# EAGLE schematic IF amplifier MC1350 (EAGLE 9.1.2)
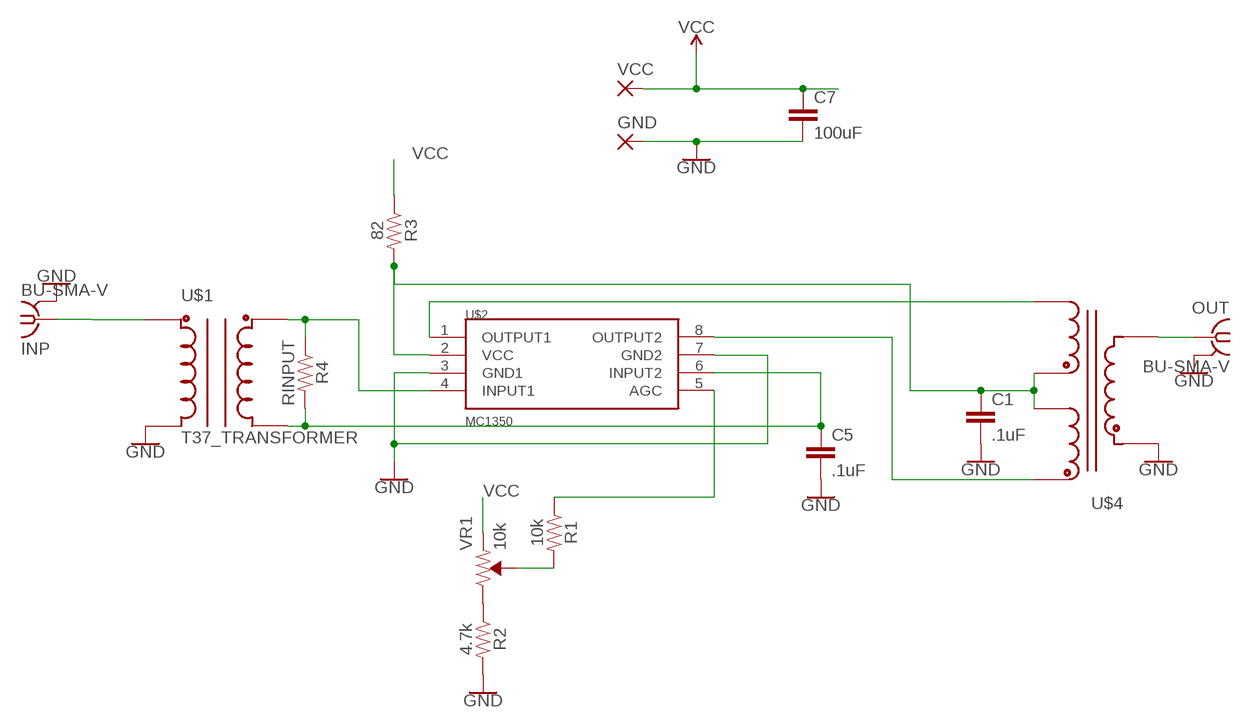
[diagram p0: schematic, sheet 1]

## Parts
C1  .1uF  C5/3.5  [C5B3.5]
C5  .1uF  C5/3.5  [C5B3.5]
C7  100uF  C5/3.5  [C5B3.5]
GND  3,17/1,1  [3,17/1,1]
INP  BU-SMA-V  [BU-SMA-V]
OUT  BU-SMA-V  [BU-SMA-V]
R1  10k  1KOHM-HORIZ-1/4W-1%  [AXIAL-0.3]
R2  4.7k  1KOHM-HORIZ-1/4W-1%  [AXIAL-0.3]
R3  82  1KOHM-HORIZ-1/4W-1%  [AXIAL-0.3]
R4  RINPUT  1KOHM-HORIZ-1/4W-1%  [AXIAL-0.3]
U$1  T37_TRANSFORMER  [T37_TRANSFORMER]
U$2  MC1350  [DIP8]
U$4  T50_SPLITTER  [T50_SPLITTER]
VCC  3,17/1,1  [3,17/1,1]
VR1  10k  TRIMPOT-PTH-10MM-KNOB-1/2W-10%  [TRIMPOT-PTH-3386U]

## Nets
GND: C1.2 C5.2 C7.2 GND.1(P) INP.2 INP.3 INP.4 INP.5 OUT.2 OUT.3 OUT.4 OUT.5 R2.P$2 U$1.C1A U$2.3(GND1) U$2.7(GND2) U$4.C1B
N$1: R4.P$1 U$1.C2B U$2.4(INPUT1)
N$2: U$2.1(OUTPUT1) U$4.C2B(C3A)
N$3: R2.P$1 VR1.3(CW)
N$4: OUT.1 U$4.C1A
N$5: C1.1 R3.P$2 U$2.2(VCC) U$4.C2A(C3B) U$4.C3A(C2A)
N$6: U$2.8(OUTPUT2) U$4.C3B(C2B)
N$7: C5.1 R4.P$2 U$1.C2A U$2.6(INPUT2)
N$8: INP.1 U$1.C1B
N$11: R1.P$1 U$2.5(AGC)
N$12: R1.P$2 VR1.2(WIPER)
VCC: C7.1 R3.P$1 VCC.1(P) VR1.1(CCW)

## Library data of the parts
C1 C5 C7 = capacitor-wima:C: CAPACITOR naming: grid - package width
GND VCC = wirepad:3,17/1,1: THROUGH-HOLE PAD
INP OUT = con-coax:BU-SMA-V: FEMALE SMA CONNECTOR Radiall distributor RS 112-3794; OC_FARNELL: unknown; OC_NEWARK: unknown
R1-R4 = SparkFun-Resistors:1KOHM: 1kΩ resistor A resistor is a passive two-terminal electrical component that implements electrical resistance as a circuit element. Resistors act to reduce current flow, and, at the same time, act to lower voltage levels within circuits. - Wikipedia; PROD_ID: RES-12182; VALUE: 1k
U$1 = toroid:T37_TRANSFORMER: Transformer wound on a T37 Toroid
U$2 = SparkFun-IC-Microcontroller:MC1350: The MC1350 is an integrated circuit featuring wide range AGC for use as an IF amplifier in radio and TV over an operating temperature range of 0° to +75°C. • Power Gain: 50 dB Typ at 45 MHZ • Power Gain: 50 dB Typ at 58 MHZ • AGC Range: 60 dB Min, DC to 45 MHz • Nearly Constant Input & Output Admittance over the Entire AGC Range • Y21 Constant ( –3.0 dB) to 90 MHz • Low Reverse Transfer Admittance: < < 1.0 µmho Typ • 12 V Operation, Single–Polarity Power Supply
U$4 = toroid:T50_SPLITTER: Transformer (having 3 windings) on a T50 Toroid
VR1 = SparkFun-Resistors:TRIMPOT: Trimming Potentiometer (Trimpot) Three-terminal potentiometers, with an adjustable wiper and two adjustable resistors. A pot can be used to create a configurable voltage divider, or as a variable resistor. "Trimpots" are a subset of potentiometers, usually intended for "set-and-forget" applications. They're often more delicate than standard potentiometers - rated for fewer turns. Variants PTH-KNOB - PTH Trimpot w/ finger-adjustable knob Trimpot 10K with Knob <https://www.sparkfun.com/products/9806> (COM-09806) Datasheet <http://www.sparkfun.com/datasheets/Components/General/TSR-3386.pdf> SMD-3MM-CLOSED-FRAME - SMD 3mm Square Closed-Frame Trimpot Used on e.g. EasyDriver - Stepper Motor Driver <https://www.sparkfun.com/products/12779> Datasheet <http://www.bitechnologies.com/pdfs/22.pdf> (22AR10KTR) SMD-5MM - SMD 5mm Square Closed-Frame Trimpot Used on e.g. IOIO-OTG - V2.2 <https://www.sparkfun.com/products/13613> Datasheet <http://www.vishay.com/docs/51008/ts53.pdf> (TS53YL502MR10) SMD-3MM-1/10W-25% - 3mm Square Open-Frame Trimpot Used on e.g. SparkFun Shapeoko <https://www.sparkfun.com/products/13899> Datasheet <http://www.bourns.com/docs/Product-Datasheets/TC33.pdf> (TC33X-2-103E); PROD_ID: RES-09730; SF_SKU: COM-09806

## Net classes
0 default: width 0.762 mm, drill 0.762 mm, clearance 0.508 mm